# EAGLE design AD1939 Full (EAGLE 6.3)
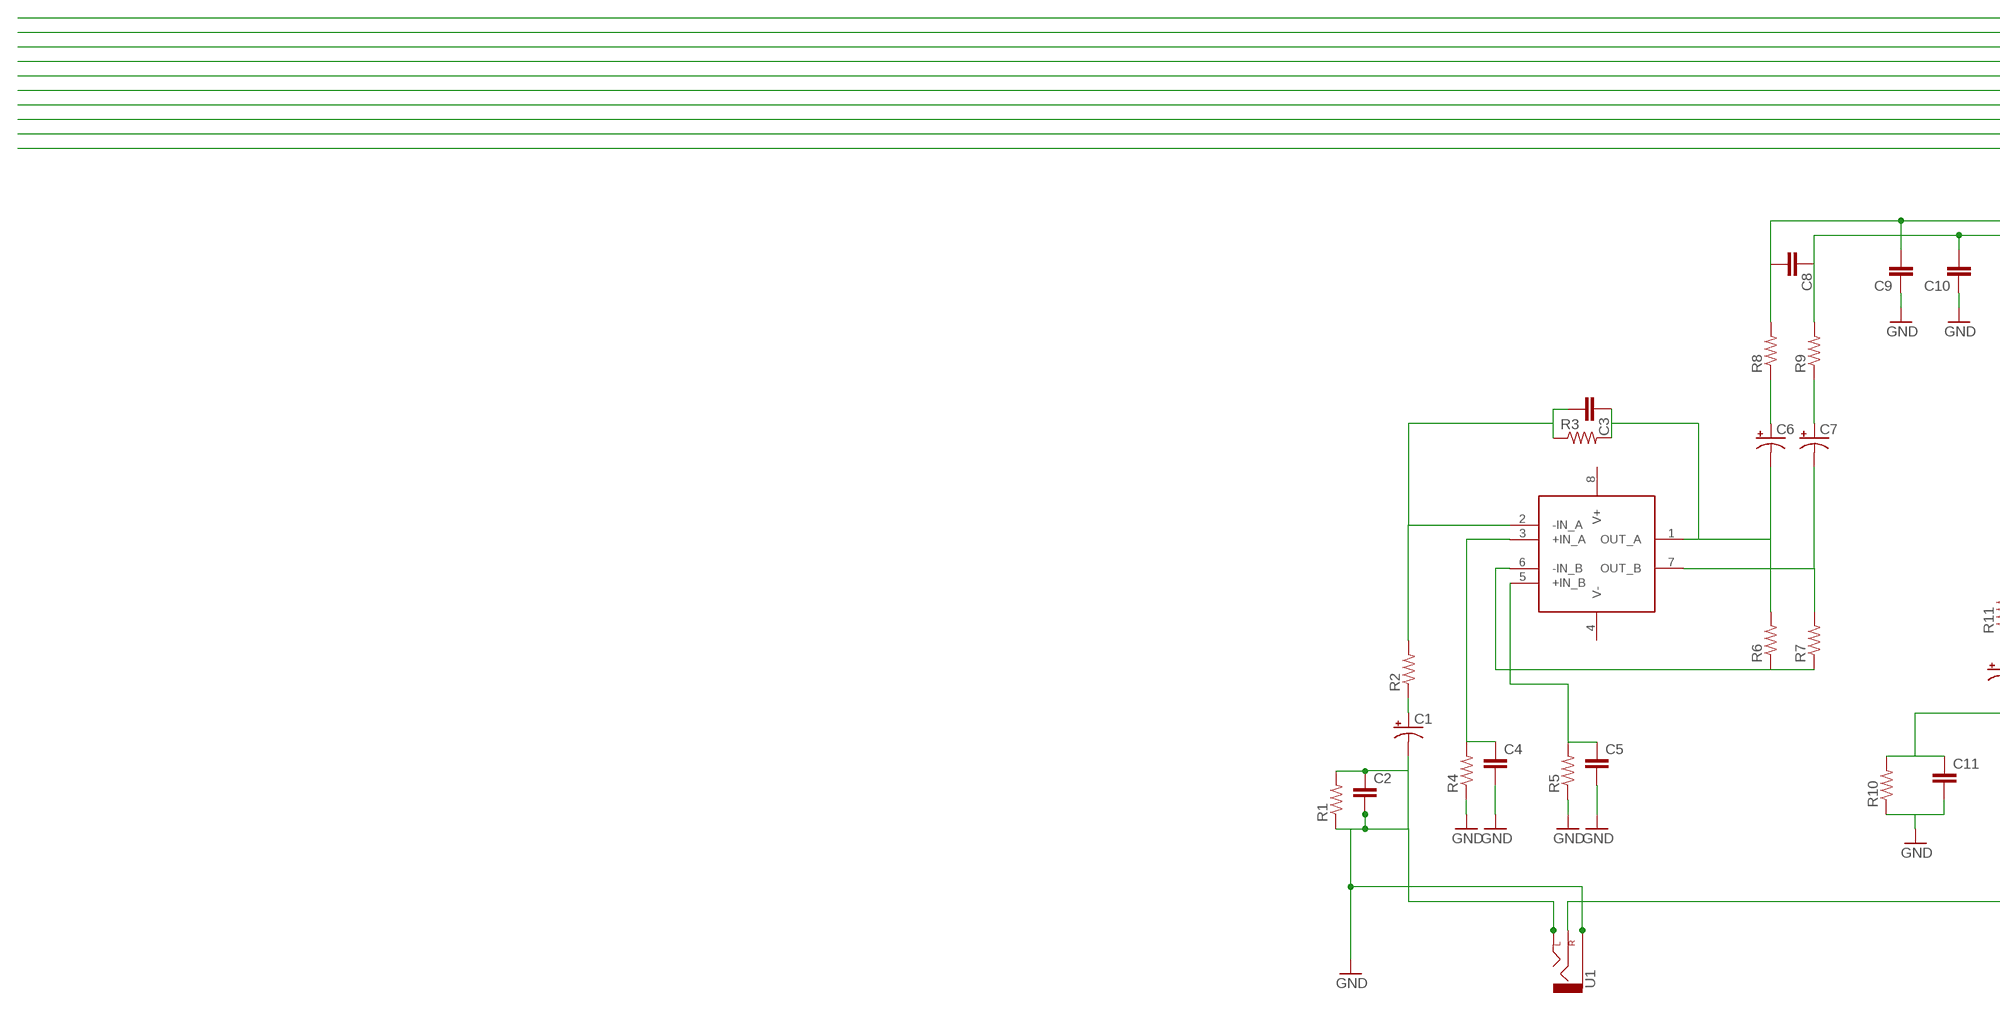
[diagram p0: schematic, sheet 1, part 1 of 2]
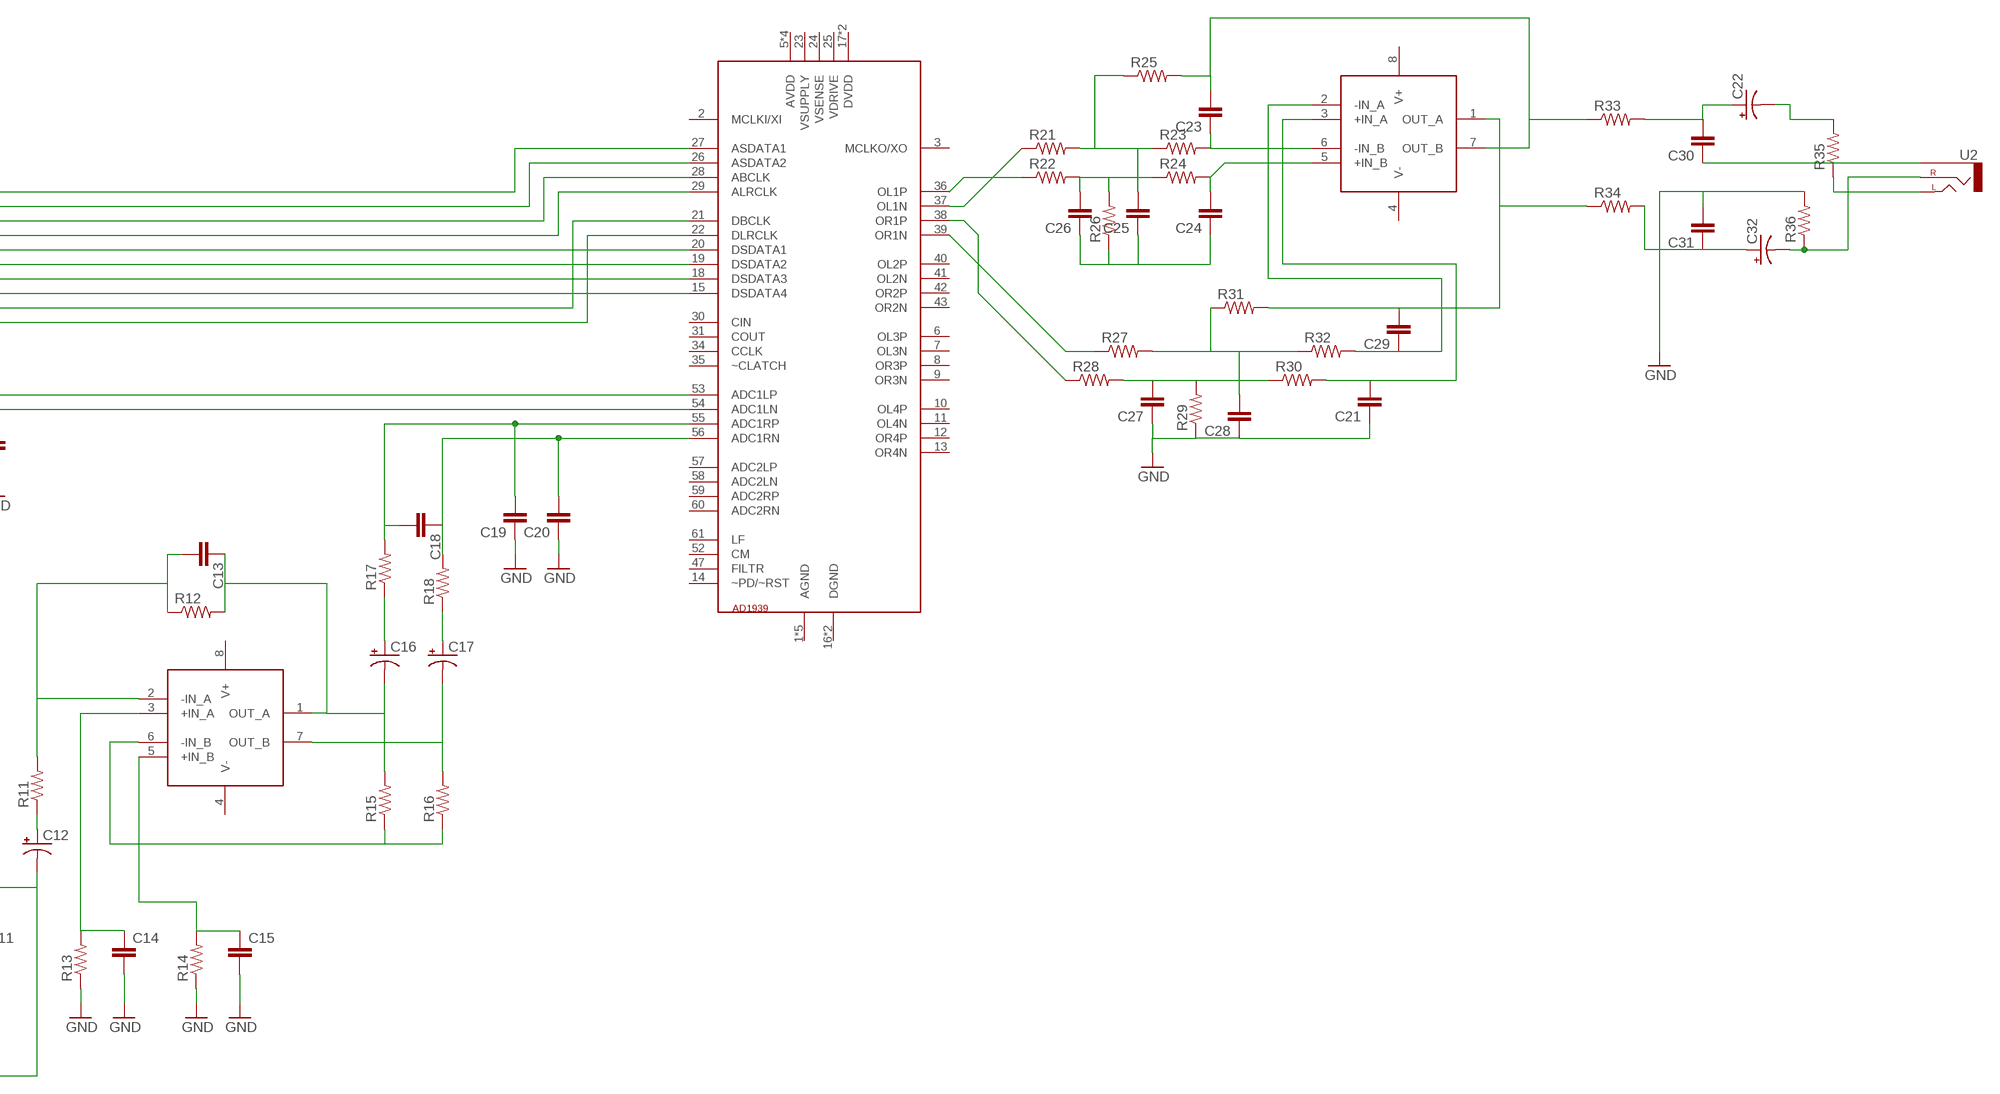
[diagram p1: schematic, sheet 1, part 2 of 2]

## Parts
C1  CAP_POL3528  [EIA3528]
C2  CAP0603-CAP  [0603-CAP]
C3  CAP0603-CAP  [0603-CAP]
C4  CAP0603-CAP  [0603-CAP]
C5  CAP0603-CAP  [0603-CAP]
C6  CAP_POL3528  [EIA3528]
C7  CAP_POL3528  [EIA3528]
C8  CAP0603-CAP  [0603-CAP]
C9  CAP0603-CAP  [0603-CAP]
C10  CAP0603-CAP  [0603-CAP]
C11  CAP0603-CAP  [0603-CAP]
C12  CAP_POL3528  [EIA3528]
C13  CAP0603-CAP  [0603-CAP]
C14  CAP0603-CAP  [0603-CAP]
C15  CAP0603-CAP  [0603-CAP]
C16  CAP_POL3528  [EIA3528]
C17  CAP_POL3528  [EIA3528]
C18  CAP0603-CAP  [0603-CAP]
C19  CAP0603-CAP  [0603-CAP]
C20  CAP0603-CAP  [0603-CAP]
C21  CAP0603-CAP  [0603-CAP]
C22  CAP_POL3528  [EIA3528]
C23  CAP0603-CAP  [0603-CAP]
C24  CAP0603-CAP  [0603-CAP]
C25  CAP0603-CAP  [0603-CAP]
C26  CAP0603-CAP  [0603-CAP]
C27  CAP0603-CAP  [0603-CAP]
C28  CAP0603-CAP  [0603-CAP]
C29  CAP0603-CAP  [0603-CAP]
C30  CAP0603-CAP  [0603-CAP]
C31  CAP0603-CAP  [0603-CAP]
C32  CAP_POL3528  [EIA3528]
R1  RESISTOR0603-RES  [0603-RES]
R2  RESISTOR0603-RES  [0603-RES]
R3  RESISTOR0603-RES  [0603-RES]
R4  RESISTOR0603-RES  [0603-RES]
R5  RESISTOR0603-RES  [0603-RES]
R6  RESISTOR0603-RES  [0603-RES]
R7  RESISTOR0603-RES  [0603-RES]
R8  RESISTOR0603-RES  [0603-RES]
R9  RESISTOR0603-RES  [0603-RES]
R10  RESISTOR0603-RES  [0603-RES]
R11  RESISTOR0603-RES  [0603-RES]
R12  RESISTOR0603-RES  [0603-RES]
R13  RESISTOR0603-RES  [0603-RES]
R14  RESISTOR0603-RES  [0603-RES]
R15  RESISTOR0603-RES  [0603-RES]
R16  RESISTOR0603-RES  [0603-RES]
R17  RESISTOR0603-RES  [0603-RES]
R18  RESISTOR0603-RES  [0603-RES]
R21  RESISTOR0603-RES  [0603-RES]
R22  RESISTOR0603-RES  [0603-RES]
R23  RESISTOR0603-RES  [0603-RES]
R24  RESISTOR0603-RES  [0603-RES]
R25  RESISTOR0603-RES  [0603-RES]
R26  RESISTOR0603-RES  [0603-RES]
R27  RESISTOR0603-RES  [0603-RES]
R28  RESISTOR0603-RES  [0603-RES]
R29  RESISTOR0603-RES  [0603-RES]
R30  RESISTOR0603-RES  [0603-RES]
R31  RESISTOR0603-RES  [0603-RES]
R32  RESISTOR0603-RES  [0603-RES]
R33  RESISTOR0603-RES  [0603-RES]
R34  RESISTOR0603-RES  [0603-RES]
R35  RESISTOR0603-RES  [0603-RES]
R36  RESISTOR0603-RES  [0603-RES]
U1  AUDIO-JACKSMD2  [AUDIO-JACK-3.5MM-SMD]
U2  AUDIO-JACKSMD2  [AUDIO-JACK-3.5MM-SMD]
U$2  AD1939  [QFP64]
U$3  OP275  [SO-8]
U$4  OP275  [SO-8]
U$5  OP275  [SO-8]

## Nets
ABCLK: U$2.28(ABCLK)
ADC1LM: C8.1 C10.2 R9.2 U$2.54(ADC1LN)
ADC1LP: C8.2 C9.2 R8.2 U$2.53(ADC1LP)
ADC1RN: C18.1 C20.2 R18.2 U$2.56(ADC1RN)
ADC1RP: C18.2 C19.2 R17.2 U$2.55(ADC1RP)
ALRCLK: U$2.29(ALRCLK)
ASDATA1: U$2.27(ASDATA1)
ASDATA2: U$2.26(ASDATA2)
DBCLK: U$2.21(DBCLK)
DLRCLK: U$2.22(DLRCLK)
DSDATA1: U$2.20(DSDATA1)
DSDATA2: U$2.19(DSDATA2)
DSDATA3: U$2.18(DSDATA3)
DSDATA4: U$2.15(DSDATA4)
GND: C1.C(-) C2.1 C2.2 C4.2 C5.2 C9.1 C10.1 C11.2 C14.2 C15.2 C19.1 C20.1 C21.1 C27.1 C28.1 C31.2 R1.1 R1.2 R4.1 R5.1 R10.1 R13.1 R14.1 R29.1 R36.2 U1.SLEEVE U1.TIP(LEFT)
HP_RIGHT_INPUT: C11.1 C12.C(-) R10.2 U1.RING(RIGHT)
LEFT_+IN_A: C4.1 R4.2 U$3.3(+IN_A)
LEFT_+IN_B: C5.1 R5.2 U$3.5(+IN_B)
LEFT_-IN_A: C3.2 R2.2 R3.1 U$3.2(-IN_A)
LEFT_=IN_B: R6.1 R7.1 U$3.6(-IN_B)
LEFT_OUT_A: C6.C(-) R6.2 U$3.1(OUT_A)
LEFT_OUT_B: C7.C(-) R7.2 U$3.7(OUT_B)
N$2: C1.A(+) R2.1
N$3: C25.2 R21.2 R23.1 R25.1
N$5: C3.1 R3.2
N$6: C26.2 R22.2 R24.1 R26.2
N$10: C6.A(+) R8.1
N$11: C7.A(+) R9.1
N$13: C27.2 R28.2 R29.2 R30.1
N$16: C28.2 R27.2 R31.1 R32.1
N$17: C12.A(+) R11.1
N$22: C16.A(+) R17.1
N$23: C17.A(+) R18.1
N$24: C22.A(+) C30.2 R33.2
N$27: C22.C(-) R35.2
N$30: C31.1 C32.A(+) R34.2
OL1N: R21.1 U$2.37(OL1N)
OL1P: R22.1 U$2.36(OL1P)
OL1P_FUNK: C24.1 C25.1 C26.1 R26.1
OR1N: R27.1 U$2.39(OR1N)
OR1P: R28.1 U$2.38(OR1P)
OUT_+IN_A: C21.2 R30.2 U$5.3(+IN_A)
OUT_+IN_B: C24.2 R24.2 U$5.5(+IN_B)
OUT_-IN)B: C23.1 R23.2 U$5.6(-IN_B)
OUT_-IN_A: C29.1 R32.2 U$5.2(-IN_A)
OUT_L: R35.1 U2.TIP(LEFT)
OUT_OUT_A: C29.2 R31.2 R34.1 U$5.1(OUT_A)
OUT_OUT_B: C23.2 R25.2 R33.1 U$5.7(OUT_B)
OUT_R: C32.C(-) R36.1 U2.RING(RIGHT)
OUT_SLEEVE: C30.1 U2.SLEEVE
RIGHT_+IN_A: C14.1 R13.2 U$4.3(+IN_A)
RIGHT_+IN_B: C15.1 R14.2 U$4.5(+IN_B)
RIGHT_-IN_A: C13.2 R11.2 R12.1 U$4.2(-IN_A)
RIGHT_OUT_A: C13.1 C16.C(-) R12.2 R15.2 U$4.1(OUT_A)
RIGHT_OUT_B: C17.C(-) R16.2 U$4.7(OUT_B)
RIHGT_-IN_A: R15.1 R16.1 U$4.6(-IN_B)
Unconnected: U$2.1(AGND) U$2.2(MCLKI/XI) U$2.3(MCLKO/XO) U$2.4(AGND) U$2.5(AVDD) U$2.6(OL3P) U$2.7(OL3N) U$2.8(OR3P) U$2.9(OR3N) U$2.10(OL4P) U$2.11(OL4N) U$2.12(OR4P) U$2.13(OR4N) U$2.14(~PD/~RST) U$2.16(DGND) U$2.17(DVDD) U$2.23(VSUPPLY) U$2.24(VSENSE) U$2.25(VDRIVE) U$2.30(CIN) U$2.31(COUT) U$2.32(DVDD) U$2.33(DGND) U$2.34(CCLK) U$2.35(~CLATCH) U$2.40(OL2P) U$2.41(OL2N) U$2.42(OR2P) U$2.43(OR2N) U$2.44(AGND) U$2.45(AVDD) U$2.46(AGND) U$2.47(FILTR) U$2.48(AGND) U$2.51(AVDD) U$2.52(CM) U$2.57(ADC2LP) U$2.58(ADC2LN) U$2.59(ADC2RP) U$2.60(ADC2RN) U$2.61(LF) U$2.62(AVDD) U$3.4(V-) U$3.8(V+) U$4.4(V-) U$4.8(V+) U$5.4(V-) U$5.8(V+)

## Library data of the parts
C1 C6 C7 C12 C16 C17 C22 C32 = 1x05smd:CAP_POL: Capacitor Polarized These are standard SMD and PTH capacitors. Normally 10uF, 47uF, and 100uF in electrolytic and tantalum varieties. Always verify the external diameter of the through hole cap, it varies with capacity, voltage, and manufacturer. The EIA devices should be standard.
C2-C5 C8-C11 C13-C15 C18-C21 C23-C31 = 1x05smd:CAP: Capacitor Standard 0603 ceramic capacitor, and 0.1" leaded capacitor.
R1-R18 R21-R36 = 1x05smd:RESISTOR: Resistor Basic schematic elements and footprints for 0603, 1206, and PTH 1/10th watt (small) resistors.
U1 U2 = SparkFun-Connectors:AUDIO-JACK: 3.5mm Audio Jack Simple 3.5mm common PCB mount audio jack. SKU: PRT-08032
U$2 = Strutz Electronic Industries:AD1939
U$3-U$5 = Strutz Electronic Industries:OP275

## Board
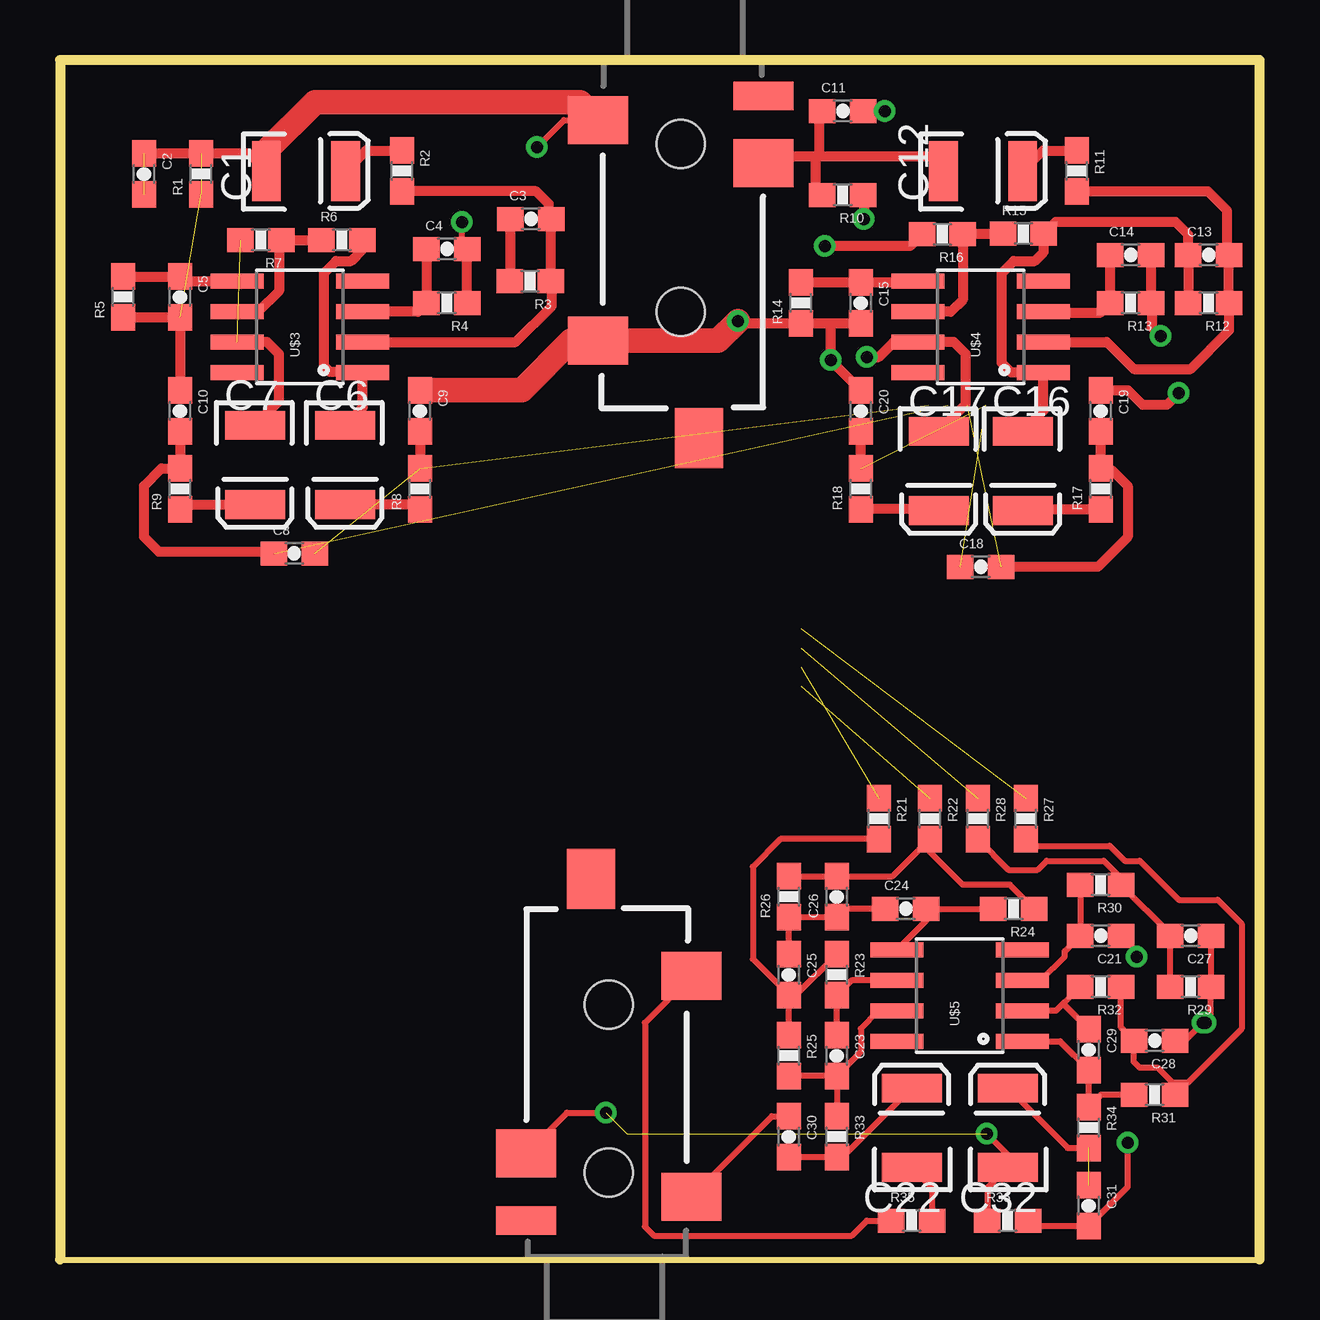
[diagram p2: board, top side]
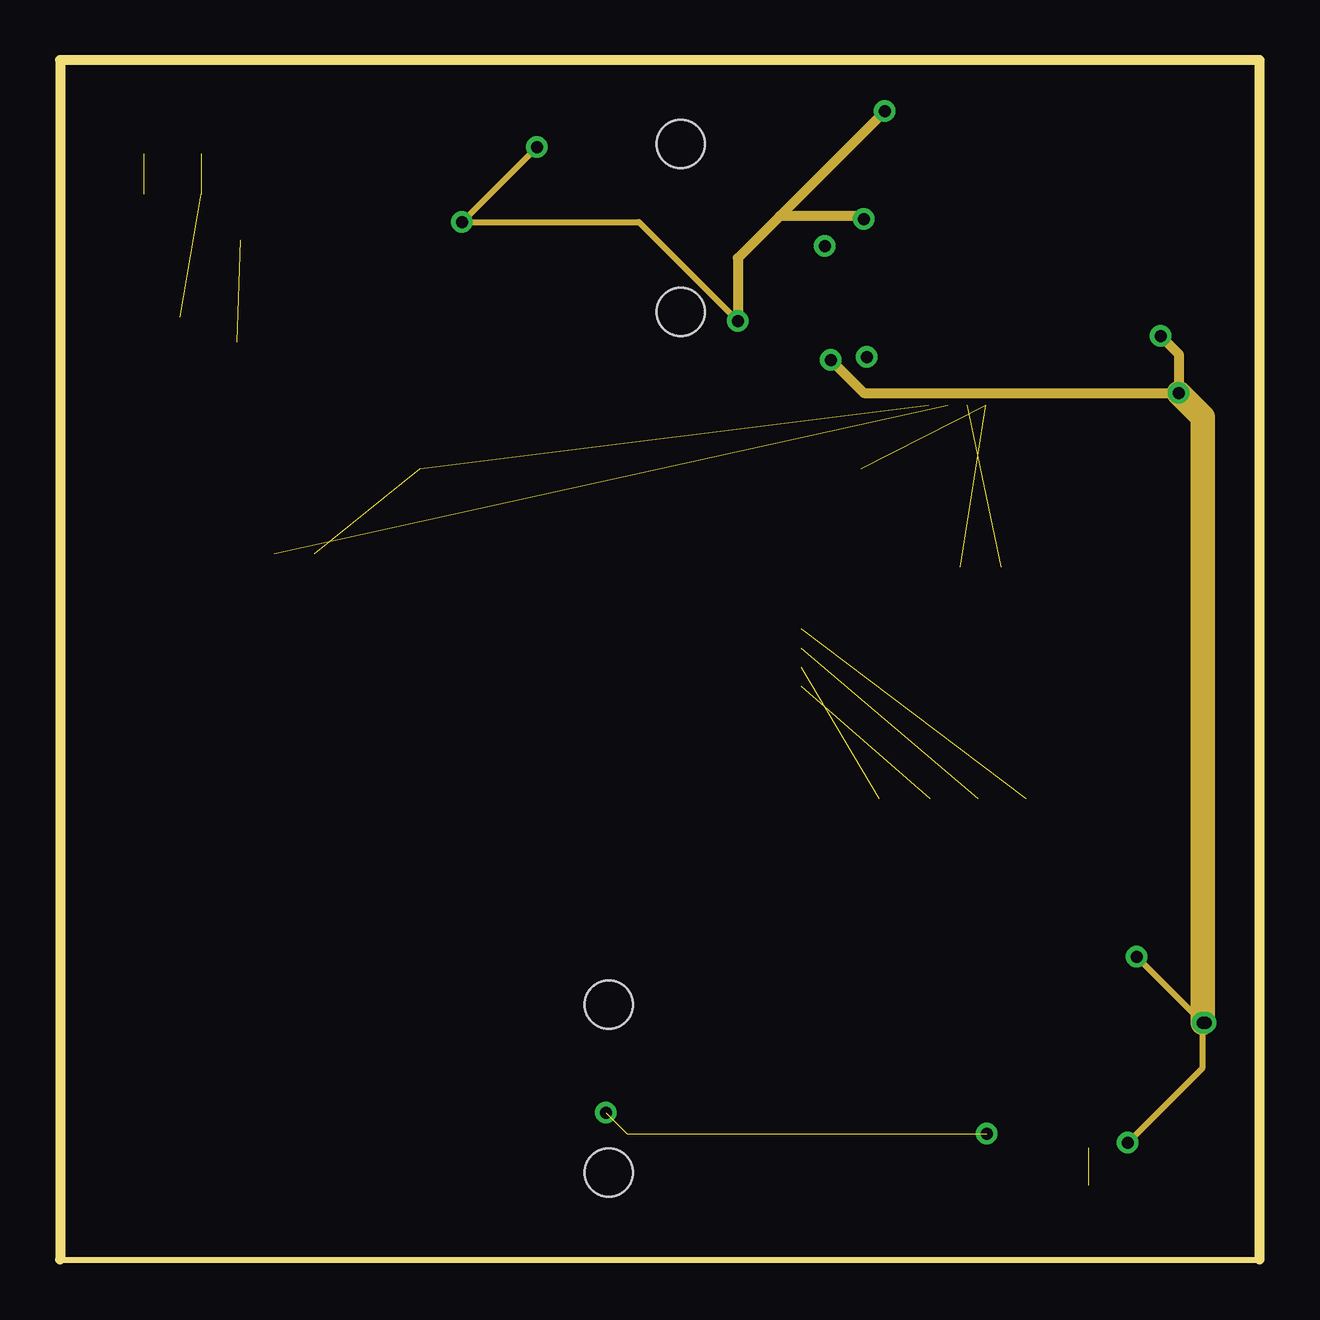
[diagram p3: board, inner layer Ground]
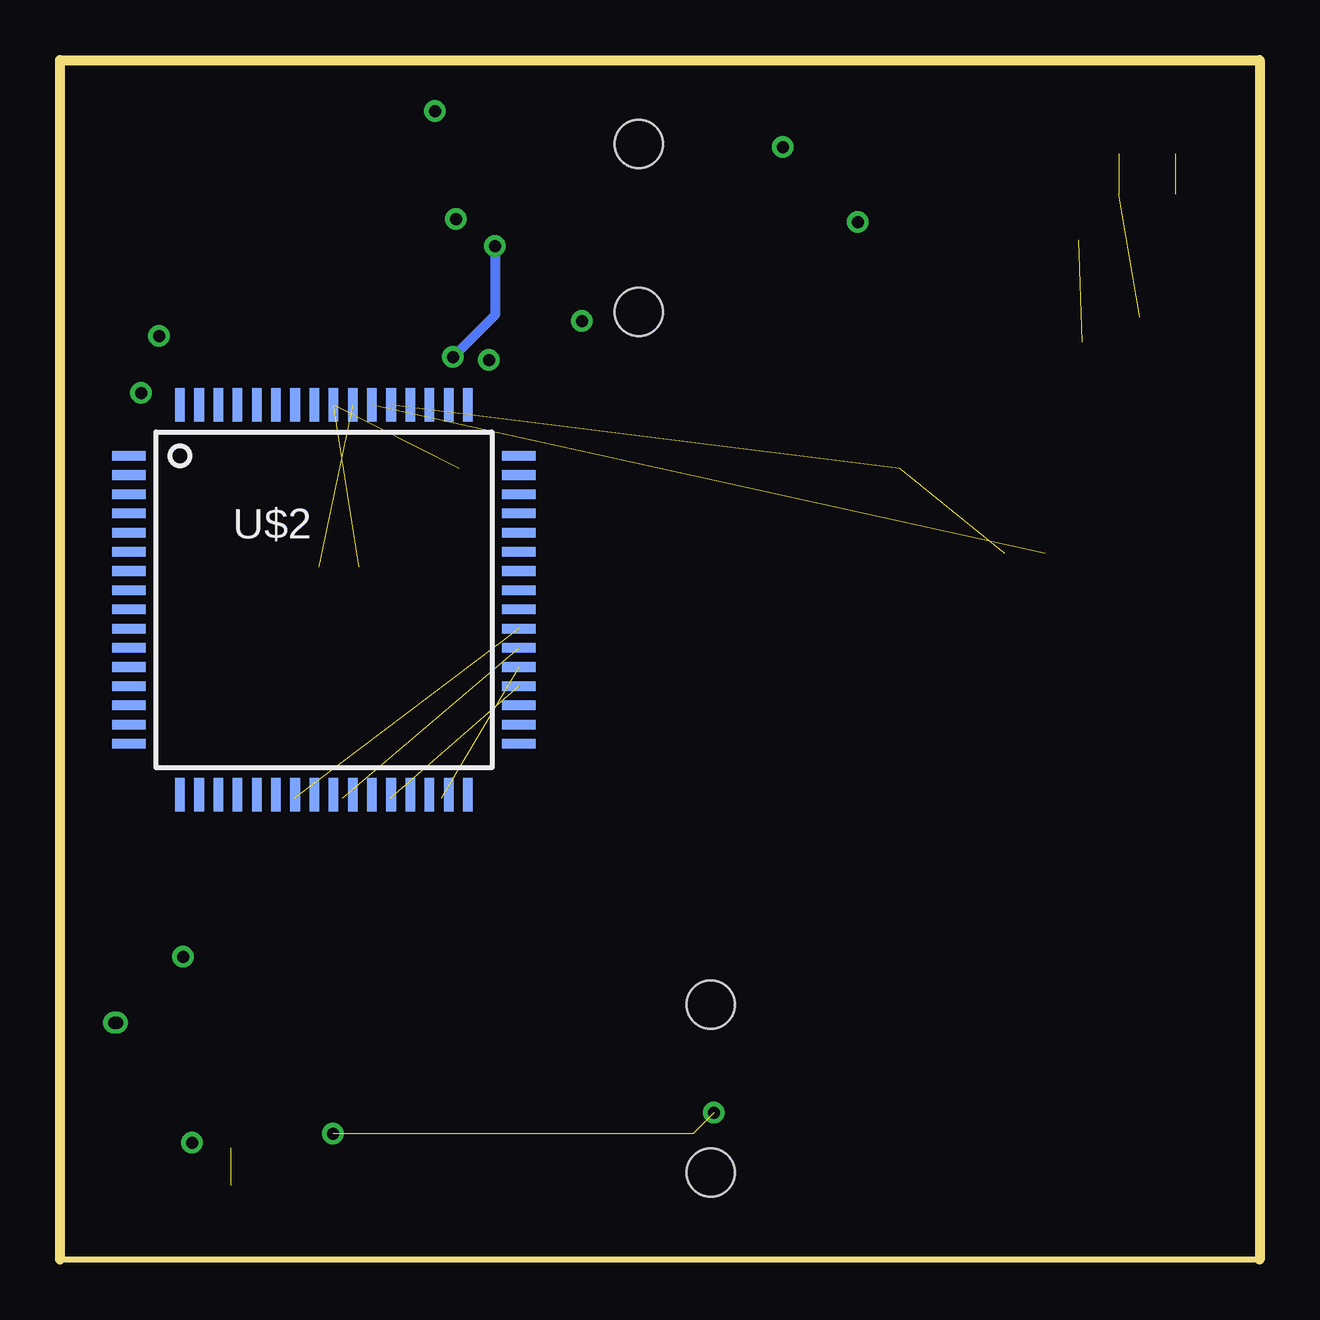
[diagram p4: board, bottom side, seen from below]

Size 50 x 50 mm. Coordinates in mm from the lower left corner, seen from the top.
Outline: 50,50 0,50 0,0 50,0 50,50
Copper layers (1*2)+(15*16): Top 0.035mm / dielectric 0.2mm / Ground 0.035mm / dielectric 1.5mm / Power 0.035mm / dielectric 0.2mm / Bottom 0.035mm
Design rules "default *": minimum track width 10mil, minimum drill 24mil, track to track 8mil, track to pad 8mil, pad to pad 8mil, via to via 8mil, smd to smd 8mil, copper to edge 40mil, drill to drill 8mil, minimum pad ring 10mil, minimum via ring 8mil, stop-mask expansion 4mil, vias tented up to drill 0mil, thermal gap 10mil

### Footprints (pad centres in the part's own frame; a part is rotated, then mirrored left to right if it is on the bottom)
EIA3528 = smd 1.2 x 2.5: A 1.65,0; C -1.65,0
0603-CAP = smd 1.1 x 1: 1 -0.85,0; 2 0.85,0
0603-RES = smd 1.1 x 1: 1 -0.85,0; 2 0.85,0
AUDIO-JACK-3.5MM-SMD = smd 2 x 2.5: RING 4.3,3.45; SLEEVE 2.5,-3.45; TIP 11.7,-3.45 | smd 1.2 x 2.5: RSH 1.5,3.45 | smd 2.5 x 2: TSH 15.75,0.75 | hole 2: 3.5,0; 10.5,0
QFP64 = smd 1.4 x 0.4: 1 -8.125,6; 2 -8.125,5.2; 3 -8.125,4.4; 4 -8.125,3.6; 5 -8.125,2.8; 6 -8.125,2; 7 -8.125,1.2; 8 -8.125,0.4; 9 -8.125,-0.4; 10 -8.125,-1.2; 11 -8.125,-2; 12 -8.125,-2.8; 13 -8.125,-3.6; 14 -8.125,-4.4; 15 -8.125,-5.2; 16 -8.125,-6; 33 8.125,-6; 34 8.125,-5.2; 35 8.125,-4.4; 36 8.125,-3.6; 37 8.125,-2.8; 38 8.125,-2; 39 8.125,-1.2; 40 8.125,-0.4; 41 8.125,0.4; 42 8.125,1.2; 43 8.125,2; 44 8.125,2.8; 45 8.125,3.6; 46 8.125,4.4; 47 8.125,5.2; 48 8.125,6 | smd 0.4 x 1.4: 17 -6,-8.125; 18 -5.2,-8.125; 19 -4.4,-8.125; 20 -3.6,-8.125; 21 -2.8,-8.125; 22 -2,-8.125; 23 -1.2,-8.125; 24 -0.4,-8.125; 25 0.4,-8.125; 26 1.2,-8.125; 27 2,-8.125; 28 2.8,-8.125; 29 3.6,-8.125; 30 4.4,-8.125; 31 5.2,-8.125; 32 6,-8.125; 49 6,8.125; 50 5.2,8.125; 51 4.4,8.125; 52 3.6,8.125; 53 2.8,8.125; 54 2,8.125; 55 1.2,8.125; 56 0.4,8.125; 57 -0.4,8.125; 58 -1.2,8.125; 59 -2,8.125; 60 -2.8,8.125; 61 -3.6,8.125; 62 -4.4,8.125; 63 -5.2,8.125; 64 -6,8.125
SO-8 = smd 0.61 x 2.21: 1 -1.905,-2.616; 2 -0.635,-2.616; 3 0.635,-2.616; 4 1.905,-2.616; 5 1.905,2.616; 6 0.635,2.616; 7 -0.635,2.616; 8 -1.905,2.616

### Placement (x,y rotation side)
C1  10.25,45.38 0 top
C2  3.5,45.25 270 top
C3  19.62,43.38 0 top
C4  16.12,42.12 0 top
C5  5,40.12 270 top
C6  11.88,33.12 270 top
C7  8.12,33.12 270 top
C8  9.77,29.43 0 top
C9  15,35.38 270 top
C10  5,35.38 270 top
C11  32.62,47.88 0 top
C12  38.48,45.38 0 top
C13  47.88,41.88 0 top
C14  44.62,41.88 0 top
C15  33.38,39.88 270 top
C16  40.12,32.88 270 top
C17  36.62,32.88 270 top
C18  38.38,28.88 0 top
C19  43.38,35.38 270 top
C20  33.38,35.38 270 top
C21  43.38,13.5 180 top
C22  35.5,5.5 90 top
C23  32.38,8.5 270 top
C24  35.25,14.62 0 top
C25  30.38,11.88 270 top
C26  32.38,15.12 90 top
C27  47.12,13.5 180 top
C28  45.62,9.12 180 top
C29  42.88,8.75 270 top
C30  30.38,5.12 270 top
C31  42.88,2.25 270 top
C32  39.5,5.5 90 top
R1  5.88,45.25 90 top
R2  14.25,45.38 270 top
R3  19.6,40.78 180 top
R4  16.12,39.88 180 top
R5  2.62,40.12 90 top
R6  11.75,42.5 0 top
R7  8.38,42.5 180 top
R8  15,32.12 90 top
R9  5,32.12 90 top
R10  32.62,44.38 180 top
R11  42.38,45.38 270 top
R12  47.88,39.88 180 top
R13  44.62,39.88 180 top
R14  30.88,39.88 90 top
R15  40.16,42.76 0 top
R16  36.78,42.74 180 top
R17  43.38,32.12 90 top
R18  33.38,32.12 90 top
R21  34.12,18.38 270 top
R22  36.25,18.38 270 top
R23  32.38,11.88 270 top
R24  39.75,14.62 180 top
R25  30.38,8.5 270 top
R26  30.38,15.12 90 top
R27  40.25,18.38 270 top
R28  38.25,18.38 270 top
R29  47.12,11.38 180 top
R30  43.38,15.62 180 top
R31  45.62,6.88 180 top
R32  43.38,11.38 180 top
R33  32.38,5.12 270 top
R34  42.88,5.5 270 top
R35  35.5,1.62 0 top
R36  39.5,1.62 0 top
U1  25.88,50 270 top
U2  22.88,0.12 90 top
U$2  39,27.5 0 bottom
U$3  10,38.88 90 top
U$4  38.38,38.88 90 top
U$5  37.5,11 90 top

### Tracks (layer width: path | path; a pad name or v marks a point on that pad's centre or on a via)
ADC1LM  (1 unrouted)
  Top 0.406: C8.1 8.85,29.5 4.12,29.5 3.5,30.12 3.5,32.25 4.22,32.97 R9.2 C10.2
ADC1LP  (2 unrouted)
  Top 0.406: C9.2 R8.2
ADC1RN  (2 unrouted)
  Top 0.406: R18.2 C20.2
ADC1RP  (1 unrouted)
  Top 0.406: C19.2 R17.2 43.48,32.88 43.88,32.88 44.5,32.25 44.5,30.12 43.25,28.88 C18.2
GND  (via drill 0.5 pad 0.25)  (3 unrouted)
  Top 0.254: 16.75,42.38 16.75,42.35 C4.2 16.98,42.15 16.75,42.38 | v19.88,46.38 21,47.5 U1.SLEEVE | 16.75,42.38 v16.75,43.25 | R36.2 40.58,1.4 C31.2 44.5,3.02 v44.5,4.88 | C27.1 R29.1 47.98,10.1 v47.75,9.88 | C21.1 44.88,12.85 v44.88,12.62 | v47.62,9.88 46.88,9.12 C28.1
  Top 0.406: C1.C 7.88,46.1 R1.2 C2.1 | R5.1 C5.2 C10.1 | 32.12,39.03 R14.1 28.35,39.03 v28.25,39.12 | 32.12,39.03 C15.2 | v45.88,38.5 45.5,38.88 45.5,39.85 R13.1 C14.2 | v46.62,36.12 46.12,35.62 45.12,35.62 44.52,36.22 C19.1 | C20.1 32.12,37.47 v32.12,37.5 32.12,39.03 | C11.2 v34.38,47.88 | R10.1 33.5,44.35 v33.5,43.38 | C4.2 R4.1 16.98,42.22 17,42.25 16.88,42.25 16.75,42.38
  Top 1.016: C9.1 15.03,36.25 19.25,36.25 21.3,38.3 U1.TIP 27.43,38.3 v28.25,39.12 | U1.SLEEVE 21.68,48.25 10.62,48.25 8.6,46.22 C1.C
  Ground 0.254: v19.88,46.38 v16.75,43.25 24.12,43.25 v28.25,39.12 | v44.88,12.62 v47.62,9.88 | v47.62,9.88 v47.75,9.88 | v44.5,4.88 47.62,8 v47.62,9.88
  Ground 0.406: v45.88,38.5 46.62,37.75 v46.62,36.12 33.5,36.12 v32.12,37.5 | v34.38,47.88 30,43.5 | 30,43.5 28.25,41.75 v28.25,39.12 | v33.5,43.38 33.38,43.5 30,43.5
  Ground 1.016: v46.62,36.12 47.62,35.12 v47.62,9.88
HP_RIGHT_INPUT
  Top 0.406: U1.RING 29.62,46 31.5,46 | 31.5,46 31.62,46 | 31.62,46 36.88,46 36.83,45.95 C12.C | R10.2 31.5,44.65 31.5,46 | C11.1 31.62,47.72 31.62,46
LEFT_+IN_A
  Top 0.406: C4.1 R4.2 14.91,39.51 U$3.3
LEFT_+IN_B
  Top 0.406: R5.2 C5.1 5.2,40.78 U$3.5
LEFT_-IN_A
  Top 0.406: R2.2 19.85,44.53 20.38,44 20.38,43.47 C3.2 20.45,43.35 R3.1 20.5,40.73 20.5,39.75 18.99,38.24 U$3.2
LEFT_=IN_B
  Top 0.406: R6.1 R7.1 9.12,42.4 9.12,40.38 8.26,39.51 U$3.6
LEFT_OUT_A
  Top 0.406: C6.C 12.62,35.52 U$3.1 12.59,37 11.25,37 11,37.25 11,41.12 11.5,41.62 12.12,41.62 12.6,42.1 R6.2
LEFT_OUT_B  (1 unrouted)
  Top 0.406: C7.C 9.12,35.78 9.12,37.75 8.63,38.24 U$3.7
N$2
  Top 0.406: C1.A 12.75,46.22 R2.1
N$3
  Top 0.254: R25.1 C25.2 | C25.2 30.68,11.02 R23.1 | R21.2 30.02,17.53 28.88,16.38 28.88,12.52 C25.2
N$5
  Top 0.406: C3.1 18.75,43.35 R3.2
N$6
  Top 0.254: R26.2 C26.2 34.7,15.97 R22.2 36.25,17 37.62,15.62 39.6,15.62 R24.1
N$10
  Top 0.406: R8.1 14.8,31.47 C6.A
N$11
  Top 0.406: R9.1 5.2,31.47 C7.A
N$13
  Top 0.254: R29.2 C27.2 46.27,13.58 R30.1 44.23,15.9 43.5,16.62 41.12,16.62 40.75,16.25 39.52,16.25 R28.2
N$16
  Top 0.254: R31.1 46.48,7.27 46.38,7.38 | 46.38,7.38 45.75,8 45,8 44.75,8.25 44.75,9.1 C28.2 44.23,9.67 R32.1 | R27.2 40.52,17.25 43.75,17.25 44.38,16.62 45,16.62 46.62,15 48.25,15 49.25,14 49.25,9.62 47,7.38 46.38,7.38
N$17
  Top 0.406: C12.A 40.98,46.22 R11.1
N$22
  Top 0.406: C16.A 40.17,31.28 R17.1
N$23
  Top 0.406: C17.A 36.58,31.28 R18.1
N$24
  Top 0.254: C30.2 R33.2 32.62,4.27 C22.A
N$27
  Top 0.254: C22.C 36.35,3 R35.2
N$30  (1 unrouted)
  Top 0.254: C32.A 42,4.65 R34.2
OL1N  (1 unrouted)
OL1P  (1 unrouted)
OL1P_FUNK
  Top 0.254: C24.1 32.73,14.62 C26.1 R26.1 C25.1
OR1N  (1 unrouted)
OR1P  (1 unrouted)
OUT_+IN_A
  Top 0.254: U$5.3 40.88,11.63 41.88,12.62 41.88,12.85 C21.2 R30.2
OUT_+IN_B
  Top 0.254: R24.2 C24.2 36.1,14.12 U$5.5
OUT_-IN)B
  Top 0.254: U$5.6 32.98,11.63 R23.2 C23.1
OUT_-IN_A
  Top 0.254: R32.2 41.89,10.74 | 41.89,10.74 41.52,10.37 U$5.2 | C29.1 41.89,10.59 41.89,10.74
OUT_L
  Top 0.254: U2.TIP 24.38,9.88 24.38,1.38 24.75,1 33,1 33.62,1.62 R35.1
OUT_OUT_A
  Top 0.254: R31.2 43.4,6.88 R34.1 C29.2 41.68,9.09 U$5.1
OUT_OUT_B
  Top 0.254: U$5.7 34.12,10.37 33.38,9.62 33.38,8.65 C23.2 | C23.2 R25.2 | C23.2 R33.1
OUT_R  (via drill 0.5 pad 0.25)  (2 unrouted)
  Top 0.254: R36.1 38.65,3 C32.C 39.5,4.38 v38.62,5.25 | U2.RING 21.12,6.12 v22.75,6.12
OUT_SLEEVE
  Top 0.254: U2.SLEEVE 29.68,5.98 C30.1
RIGHT_+IN_A
  Top 0.406: U$4.3 41.03,39.47 43.38,39.47 R13.2 C14.1
RIGHT_+IN_B
  Top 0.406: U$4.5 35.7,40.72 C15.1 R14.2
RIGHT_-IN_A
  Top 0.406: R11.2 47.85,44.53 48.62,43.75 48.62,41.97 C13.2 R12.1 48.73,38.72 47.12,37.12 44.75,37.12 43.62,38.25 U$4.2
RIGHT_OUT_A
  Top 0.406: C16.C 40.99,35.39 U$4.1 39.66,36.97 39.25,37.38 39.25,41.12 39.75,41.62 40.62,41.62 41,42 R15.2 41.49,43.25 46.5,43.25 47.02,42.72 C13.1 R12.2
RIGHT_OUT_B  (via drill 0.5 pad 0.25)
  Top 0.406: C17.C 37.75,35.65 37.75,37.75 37.26,38.24 U$4.7 | U$4.7 35.64,38.12 35.38,38.12 | R16.2 35.44,42.25 v31.88,42.25 | v33.62,37.62 34.12,37.62 34.75,38.25 U$4.7
  Bottom 0.406: v31.88,42.25 31.88,39.38 v33.62,37.62
RIHGT_-IN_A
  Top 0.406: U$4.6 37.13,39.51 37.62,40 37.62,42.25 R16.1 39.28,42.74 R15.1